# Altium schematic sheet ESP_PIC_v1.SchDoc
size B
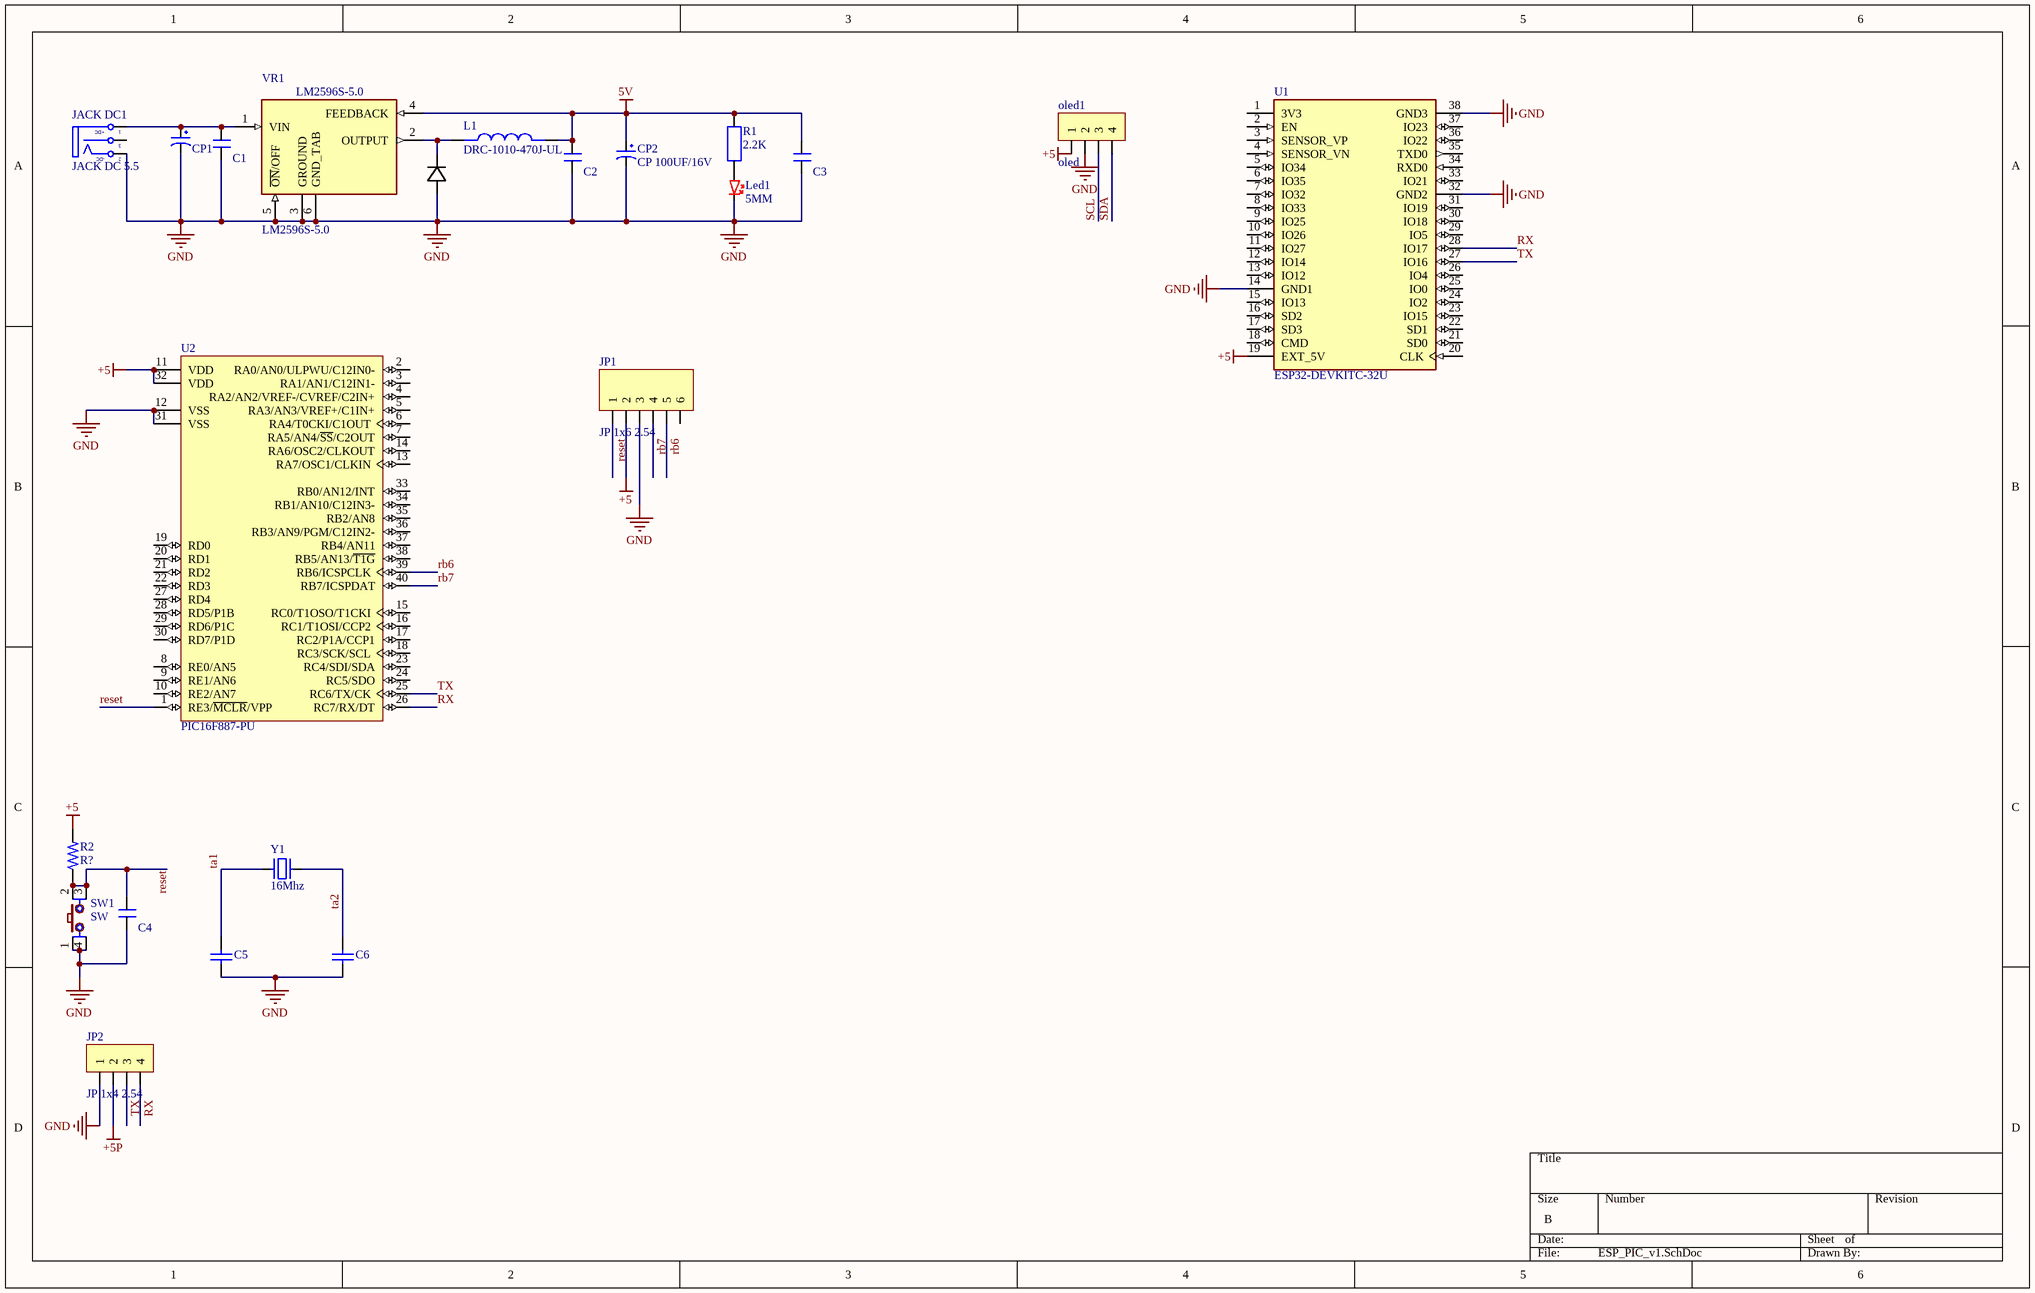
[diagram p0: ESP_PIC_v1.SchDoc]

## Parts
C1  C  [Tu gom]  (value not drawn)
C2  C  [Tu gom]  (value not drawn)
C3  C  [Tu gom]  (value not drawn)
C4  C  [Tu gom]  (value not drawn)
C5  Capacitor Ceramic  [C0805]  (value not drawn)
C6  Capacitor Ceramic  [C0805]  (value not drawn)
CP1  CP?  [C10mm]  (value not drawn)
CP2  CP 100UF/16V  [C5mm]
Diode_1N4007  Diode 1N4007  [Diode 1N4007]  (value not drawn)
JACK_DC1  JACK DC 5.5  [JACK DC 5.5]
JP1  JP 1x6 2.54  [JP 1x6 DT]
JP2  JP 1x4 2.54  [JP 1x4 DT]
L1  DRC-1010-470J-UL  [IND_DRC-1010-470J-UL]
Led1  5MM  [Led 5mm]
oled1  oled  [oled 0.96]
R1  2.2K  [Resistor 1/4W]
R2  R?  [RES 0805]
SW1  SW  [SW2-DIP]
U1  ESP32-DEVKITC-32U  [MODULE_ESP32-DEVKITC-32U]
U2  PIC16F887-PU  [DIP40]
VR1  LM2596S-5.0  [TO 263 - 5]
Y1  16Mhz  [Thach Anh 2 chan cam]

## Nets
5V: C2.2 C3.2 CP2.1 L1.2 R1.2 VR1.4(FEEDBACK)
+5: JP1.2 oled1.1 R2.2 U1.19(EXT_5V) U2.11(VDD) U2.32(VDD)
+5P: JP2.2
GND: C1.1 C2.1 C3.1 C4.1 C5.1 C6.1 CP1.2 CP2.2 Diode_1N4007.1(B) JACK_DC1.2(TN) JP1.3 JP2.1 Led1.2(B) oled1.2 SW1.1 SW1.4 U1.14(GND1) U1.32(GND2) U1.38(GND3) U2.12(VSS) U2.31(VSS) VR1.3(GROUND) VR1.5(~{ON}/OFF) VR1.6(GND_TAB)
rb6: JP1.5 U2.39(RB6/ICSPCLK)
rb7: JP1.4 U2.40(RB7/ICSPDAT)
reset: C4.2 JP1.1 R2.1 SW1.2 SW1.3 U2.1(RE3/~{MCLR}/VPP)
RX: JP2.4 U1.28(IO17) U2.26(RC7/RX/DT)
SCL: oled1.3
SDA: oled1.4
ta1: C5.2 Y1.2
ta2: C6.2 Y1.1
TX: JP2.3 U1.27(IO16) U2.25(RC6/TX/CK)
NetC1_2: C1.2 CP1.1 JACK_DC1.1(T) VR1.1(VIN)
NetDiode_1N4007_2: Diode_1N4007.2(B) L1.1 VR1.2(OUTPUT)
NetLed1_1: Led1.1(B) R1.1

Not connected (* = marked no-connect by the designer): JACK_DC1 3(S); JP1 6; U1 1(3V3) 2(EN) 3(SENSOR_VP) 4(SENSOR_VN) 5(IO34) 6(IO35) 7(IO32) 8(IO33) 9(IO25) 10(IO26) 11(IO27) 12(IO14) 13(IO12) 15(IO13) 16(SD2) 17(SD3) 18(CMD) 20(CLK) 21(SD0) 22(SD1) 23(IO15) 24(IO2) 25(IO0) 26(IO4) 29(IO5) 30(IO18) 31(IO19) 33(IO21) 34(RXD0) 35(TXD0) 36(IO22) 37(IO23); U2 2(RA0/AN0/ULPWU/C12IN0-) 3(RA1/AN1/C12IN1-) 4(RA2/AN2/VREF-/CVREF/C2IN+) 5(RA3/AN3/VREF+/C1IN+) 6(RA4/T0CKI/C1OUT) 7(RA5/AN4/~{SS}/C2OUT) 8(RE0/AN5) 9(RE1/AN6) 10(RE2/AN7) 13(RA7/OSC1/CLKIN) 14(RA6/OSC2/CLKOUT) 15(RC0/T1OSO/T1CKI) 16(RC1/T1OSI/CCP2) 17(RC2/P1A/CCP1) 18(RC3/SCK/SCL) 19(RD0) 20(RD1) 21(RD2) 22(RD3) 23(RC4/SDI/SDA) 24(RC5/SDO) 27(RD4) 28(RD5/P1B) 29(RD6/P1C) 30(RD7/P1D) 33(RB0/AN12/INT) 34(RB1/AN10/C12IN3-) 35(RB2/AN8) 36(RB3/AN9/PGM/C12IN2-) 37(RB4/AN11) 38(RB5/AN13/~{T1G})

## Notes on the sheet
- (in symbol JACK DC 5.5) +DC; -DC

## Library data of the parts
C1-C4 = TỤ GỐM: 2.54MM -DIP; Value: TỤ GỐM
C5 C6 = CapSMD: Capacitor; Value: 33p; Published: 8-Jun-2000; LatestRevisionDate: 17-Jul-2002; LatestRevisionNote: Re-released for DXP Platform.; PackageReference: RAD-0.3; Publisher: Altium Limited
CP1 = CP 1000UF/35V
CP2 = CP 100UF/16V: CP?; Value: CP 100UF/16V
Diode_1N4007 = Diode 1N4007: Diode 1N4007 DIP; Value: Diode 1N4007
JACK_DC1 = JACK DC 5.5: Value: Jac DC
JP1 = JP 1x6 2.54 Duc Thang: Cắm; Ten_Linh_Kien: Jump Đơn Đực 2.54MM 1x40P Thẳng 11MM; Don_Vi: Con; Ma_Hang: MH000903; Ghi_Chu: *; Kieu_Chan: *; Chung_Loai: Cắm
JP2 = JP 1x4 2.54 Duc Thang: Cắm; Ten_Linh_Kien: Jump Đơn Đực 2.54MM 1x40P Thẳng 11MM; Don_Vi: Con; Ma_Hang: MH000903; Ghi_Chu: *; Kieu_Chan: *; Chung_Loai: Cắm
L1 = DRC-1010-470J-UL: MF: {'manufacturer': u'Signal Transformer'}; Package: None; Price: None; Value: *; MP: DRC-1010-470J-UL; Availability: Unavailable
Led1 = LED RED 5MM: Value: LED RED 5MM
oled1 = oled 0.96: Cắm; Ten_Linh_Kien: Jump Đơn Cái 2.54MM 1x20P Thẳng; Don_Vi: Con; Ma_Hang: MH004006; Ghi_Chu: *; Kieu_Chan: *; Chung_Loai: Cắm
R1 = RESISTOR  1/4W 2.2K: DIP; Value: RESISTOR  1/4W 2.2K
R2 = RES 0805 SMD: RES 0.36 OHM 1% 1/4W 0805; Power_Rating: .25 W; Resistance: .36; MF: TE Connectivity; MP: 2-2176053-1; Value: RES 0805 SMD; Availability: In Stock; Package: 0805; EU_RoHS_Compliance: Compliant with Exemptions; Tolerance: 1%; Price: None
SW1 = SW4: Switch button 4 pin; Value: Button chip 4 pin
U1 = ESP32-DEVKITC-32U: ESP32-DEVKITC; Package: None; Availability: Unavailable; Value: ESP32-DEVKITC-32U; MP: ESP32-DEVKITC-32U; Price: None
U2 = PIC16F887-PU: Flash-Based, 8-Bit CMOS Microcontroller with nanoWatt Technology, 8K (x14-Bit words) Program Memory, 624 Bytes Data Memory, 35 I/O pins, 40-Pin PDIP, Standard VDD Range, Extended Temperature; Value: PIC16F877; Published: 29-Jan-2009; LatestRevisionDate: 02-Dec-2009; LatestRevisionNote: Updated datasheet to version revF, Apr-2009.; DatasheetVersion: revF, Apr-2009; PackageVersion: revBB, Aug-2009; PackageReference: PDIP600-P40; Publisher: Altium Limited; PackageDescription: 40-Lead Plastic Dual In-Line (P) - 600 mil Body [PDIP]; Supplier 1: Digi-Key; Supplier Part Number 1: PIC16F887-E/P-ND; Supplier 2: Farnell; Supplier Part Number 2: 1703423; ComponentLink1Description: Datasheet; ComponentLink1URL: http://ww1.microchip.com/downloads/en/DeviceDoc/41291F.pdf; ComponentLink2Description: Packaging Specification; ComponentLink2URL: http://www.microchip.com/stellent/groups/techpub_sg/documents/packagingspec/en012702.pdf; ComponentLink3Description: Microchip.com Home; ComponentLink3URL: http://www.microchip.com/
VR1 = LM2596S-5.0: SIMPLE SWITCHER&reg; 4.5V to 40V, 3A Low Component Count Step-Down Regulator; MP: LM2596S-5.0/NOPB; MF: Texas Instruments; Price: None; Availability: In Stock; Package: TO-263-5 Texas Instruments; SnapEDA_Link: https://www.snapeda.com/parts/LM2596S-5.0/NOPB/Texas+Instruments/view-part/?ref=snap; Check_prices: https://www.snapeda.com/parts/LM2596S-5.0/NOPB/Texas+Instruments/view-part/?ref=eda; Value: *; Purchase-URL: https://pricing.snapeda.com/search/part/LM2596S-5.0/NOPB/?ref=eda
Y1 = Thach Anh 2 chan Cam: Crystal For all Crystal 2pin.; Value: 4Mhz